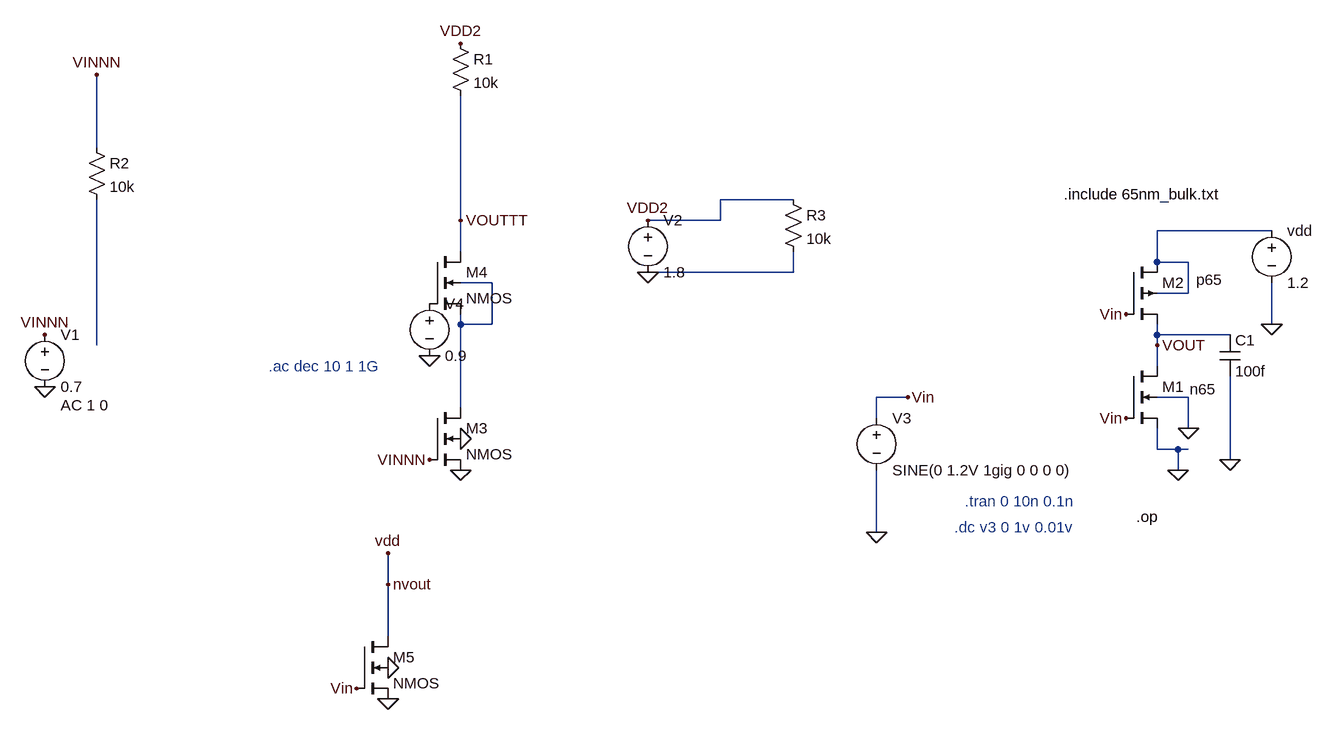
[diagram p0: schematic spice 1.asc]
spice 1.asc, the LTspice schematic file:
Version 4.1
SHEET 1 1184 780
WIRE -1424 -112 -1424 -224
WIRE -352 -32 -464 -32
WIRE -864 0 -864 -192
WIRE -464 0 -464 -32
WIRE -464 0 -576 0
WIRE 384 16 208 16
WIRE -864 48 -864 0
WIRE 208 64 208 16
WIRE 256 64 208 64
WIRE -352 80 -352 48
WIRE -352 80 -576 80
WIRE -816 96 -864 96
WIRE 256 112 256 64
WIRE 256 112 208 112
WIRE -864 160 -864 144
WIRE -816 160 -816 96
WIRE -816 160 -864 160
WIRE 384 160 384 96
WIRE 208 176 208 160
WIRE 320 176 208 176
WIRE -1424 192 -1424 -32
WIRE 208 192 208 176
WIRE 208 224 208 192
WIRE -176 272 -224 272
WIRE 256 272 208 272
WIRE -864 288 -864 160
WIRE -224 304 -224 272
WIRE 256 320 256 272
WIRE 208 352 208 320
WIRE 240 352 208 352
WIRE 256 352 240 352
WIRE 320 368 320 240
WIRE 240 384 240 352
WIRE -224 480 -224 384
WIRE -976 560 -976 512
WIRE -976 640 -976 560
FLAG 384 160 0
FLAG -176 272 Vin
FLAG -576 0 VDD2
FLAG -576 80 0
FLAG -864 384 0
FLAG -1504 256 0
FLAG -1504 176 VINNN
FLAG -912 368 VINNN
FLAG -864 0 VOUTTT
FLAG -864 336 0
FLAG -864 -272 VDD2
FLAG -976 736 0
FLAG -976 688 0
FLAG -1024 720 Vin
FLAG -976 512 vdd
FLAG -976 560 nvout
FLAG 320 368 0
FLAG 240 384 0
FLAG -224 480 0
FLAG 160 144 Vin
FLAG 160 304 Vin
FLAG 256 320 0
FLAG 208 192 VOUT
FLAG -912 208 0
FLAG -1424 -224 VINNN
DATAFLAG -1424 -160 ""
DATAFLAG -1424 112 ""
SYMBOL nmos4 160 224 R0
WINDOW 3 98 36 Left 2
SYMATTR Value n65
SYMATTR InstName M1
SYMATTR Value2 l=65n w=0.5u
SYMBOL pmos4 160 64 R0
WINDOW 3 108 27 Left 2
SYMATTR Value p65
SYMATTR InstName M2
SYMATTR Value2 l=65n w=1u
SYMBOL voltage 384 0 R0
WINDOW 123 0 0 Left 0
WINDOW 39 0 0 Left 0
SYMATTR InstName vdd
SYMATTR Value 1.2
SYMBOL cap 304 176 R0
SYMATTR InstName C1
SYMATTR Value 100f
SYMBOL voltage -1504 160 R0
WINDOW 123 24 124 Left 2
WINDOW 39 0 0 Left 0
SYMATTR Value2 AC 1 0
SYMATTR InstName V1
SYMATTR Value 0.7
SYMBOL nmos4 -912 288 R0
SYMATTR InstName M3
SYMATTR Value2 w=1U
SYMBOL voltage -576 -16 R0
WINDOW 123 0 0 Left 0
WINDOW 39 0 0 Left 0
SYMATTR InstName V2
SYMATTR Value 1.8
SYMBOL res -880 -288 R0
SYMATTR InstName R1
SYMATTR Value 10k
SYMBOL voltage -224 288 R0
WINDOW 123 0 0 Left 0
WINDOW 39 0 0 Left 0
SYMATTR InstName V3
SYMATTR Value SINE(0 1.2V 1gig 0 0 0 0)
SYMBOL nmos4 -1024 640 R0
SYMATTR InstName M5
SYMBOL nmos4 -912 48 R0
SYMATTR InstName M4
SYMATTR Value2 w=1U
SYMBOL voltage -912 112 R0
WINDOW 123 0 0 Left 0
WINDOW 39 0 0 Left 0
SYMATTR InstName V4
SYMATTR Value 0.9
SYMBOL res -1440 -128 R0
SYMATTR InstName R2
SYMATTR Value 10k
SYMBOL res -368 -48 R0
SYMATTR InstName R3
SYMATTR Value 10k
TEXT -88 432 Left 2 ;.tran 0 10n 0.1n
TEXT -104 472 Left 2 ;.dc v3 0 1v 0.01v
TEXT 176 456 Left 2 !.op
TEXT 64 -40 Left 2 !.include 65nm_bulk.txt
TEXT -1160 224 Left 2 ;.ac dec 10 1 1G

The netlist it stands for:
* spice 1.asc
M1 VOUT Vin 0 0 n65 l=65n w=0.5u
M2 N001 Vin VOUT N001 p65 l=65n w=1u
vdd N001 0 1.2
C1 VOUT 0 100f
V1 VINNN 0 0.7 AC 1 0
M3 N002 VINNN 0 0 NMOS w=1U
V2 VDD2 0 1.8
R1 VDD2 VOUTTT 10k
V3 Vin 0 SINE(0 1.2V 1gig 0 0 0 0)
M5 nvout Vin 0 0 NMOS
M4 VOUTTT P001 N002 N002 NMOS w=1U
V4 P001 0 0.9
R2 VINNN N003 10k
R3 VDD2 0 10k
.model NMOS NMOS
.model PMOS PMOS
.lib standard.mos
* .tran 0 10n 0.1n
* .dc v3 0 1v 0.01v
.op
.include 65nm_bulk.txt
* .ac dec 10 1 1G
.backanno
.end